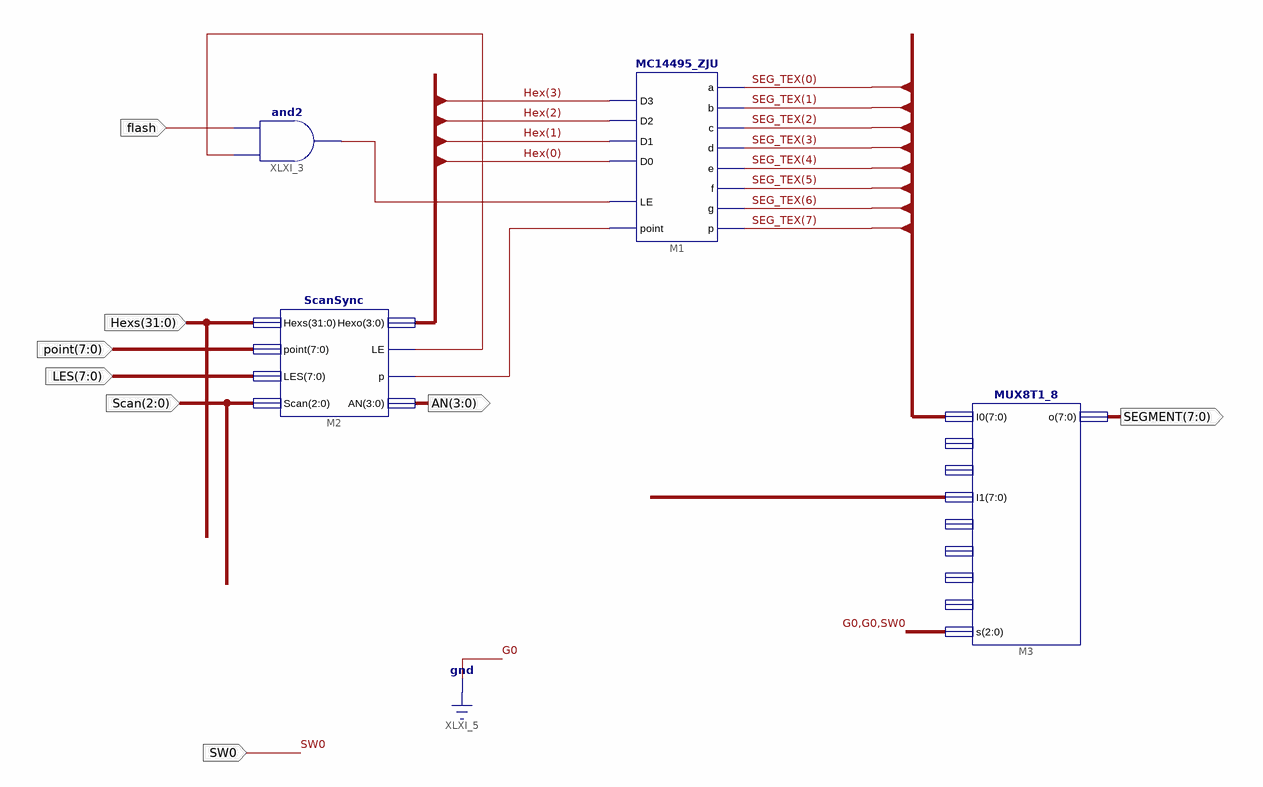
[diagram p0: schematic sheet 1]
// Xilinx ISE schematic Seg7_Dev.sch (kintex7) as structural Verilog: 4 symbols, 8 ports
module Seg7_Dev (
  input  [31:0] Hexs,
  input  [2:0] Scan,
  input  [7:0] point,
  input  [7:0] LES,
  input  flash,
  input  SW0,
  output [3:0] AN,
  output [7:0] SEGMENT
);

  wire XLXN_6, XLXN_13, XLXN_14;
  wire [3:0] Hex;
  wire [7:0] SEG_TEX, XLXN_19;

  ScanSync M2 (.Hexs(Hexs), .point(point), .LES(LES), .Scan(Scan), .Hexo(Hex), .LE(XLXN_13), .p(XLXN_6), .AN(AN));
  MC14495_ZJU M1 (
    .D0(Hex[0]), .D1(Hex[1]), .D2(Hex[2]), .D3(Hex[3]), .p(SEG_TEX[7]), .g(SEG_TEX[6]), .f(SEG_TEX[5]),
    .e(SEG_TEX[4]), .d(SEG_TEX[3]), .c(SEG_TEX[2]), .b(SEG_TEX[1]), .a(SEG_TEX[0]), .point(XLXN_6),
    .LE(XLXN_14));
  and XLXI_3 (XLXN_14, XLXN_13, flash);
  MUX8T1_8 M3 (.I0(SEG_TEX), .I1(XLXN_19), .s({2'b00, SW0}), .o(SEGMENT));  // open: I3, I2, I4, I7, I6, I5
endmodule
